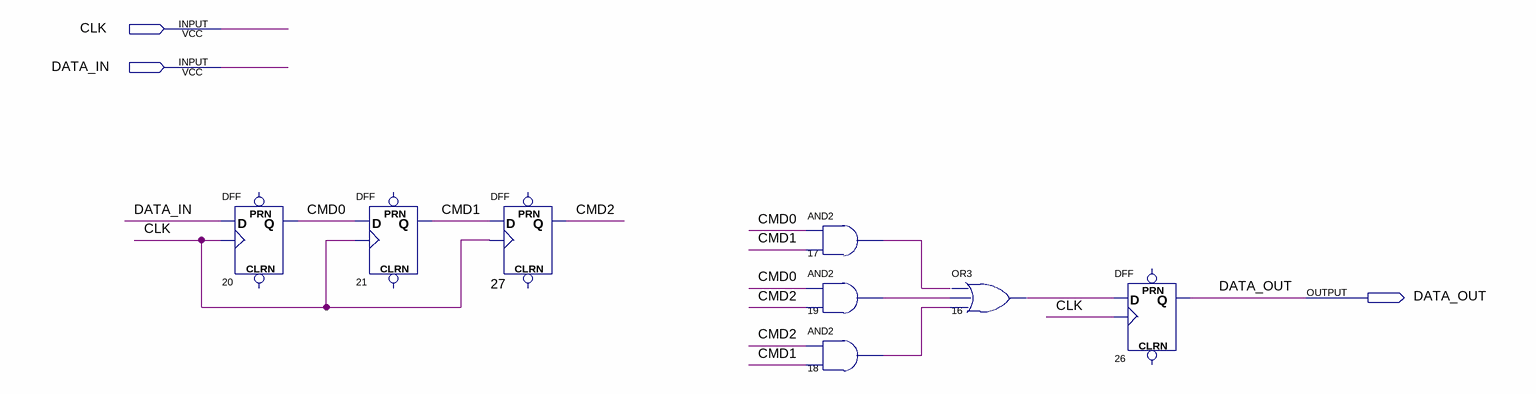
[diagram p0: schematic sheet]
// Quartus schematic major.bdf as structural Verilog: 8 symbols, 3 pins
module major (
  input  CLK,
  input  DATA_IN,
  output DATA_OUT
);

  wire CMD0, CMD1, CMD2, n16_out, n17_out, n18_out, n19_out;

  DFF u_20 (.CLK(CLK), .D(DATA_IN), .Q(CMD0));  // open: CLRN, PRN
  DFF u_21 (.CLK(CLK), .D(CMD0), .Q(CMD1));  // open: CLRN, PRN
  DFF u_27 (.CLK(CLK), .D(CMD1), .Q(CMD2));  // open: CLRN, PRN
  and u_17 (n17_out, CMD0, CMD1);
  and u_19 (n19_out, CMD0, CMD2);
  and u_18 (n18_out, CMD2, CMD1);
  or u_16 (n16_out, n17_out, n19_out, n18_out);
  DFF u_26 (.CLK(CLK), .D(n16_out), .Q(DATA_OUT));  // open: CLRN, PRN
endmodule
